# Altium schematic sheet rfid_reader.SchDoc
size 297 x 209 mm; DrawnBy: Supun; Engineer: Supun; Organization: C3
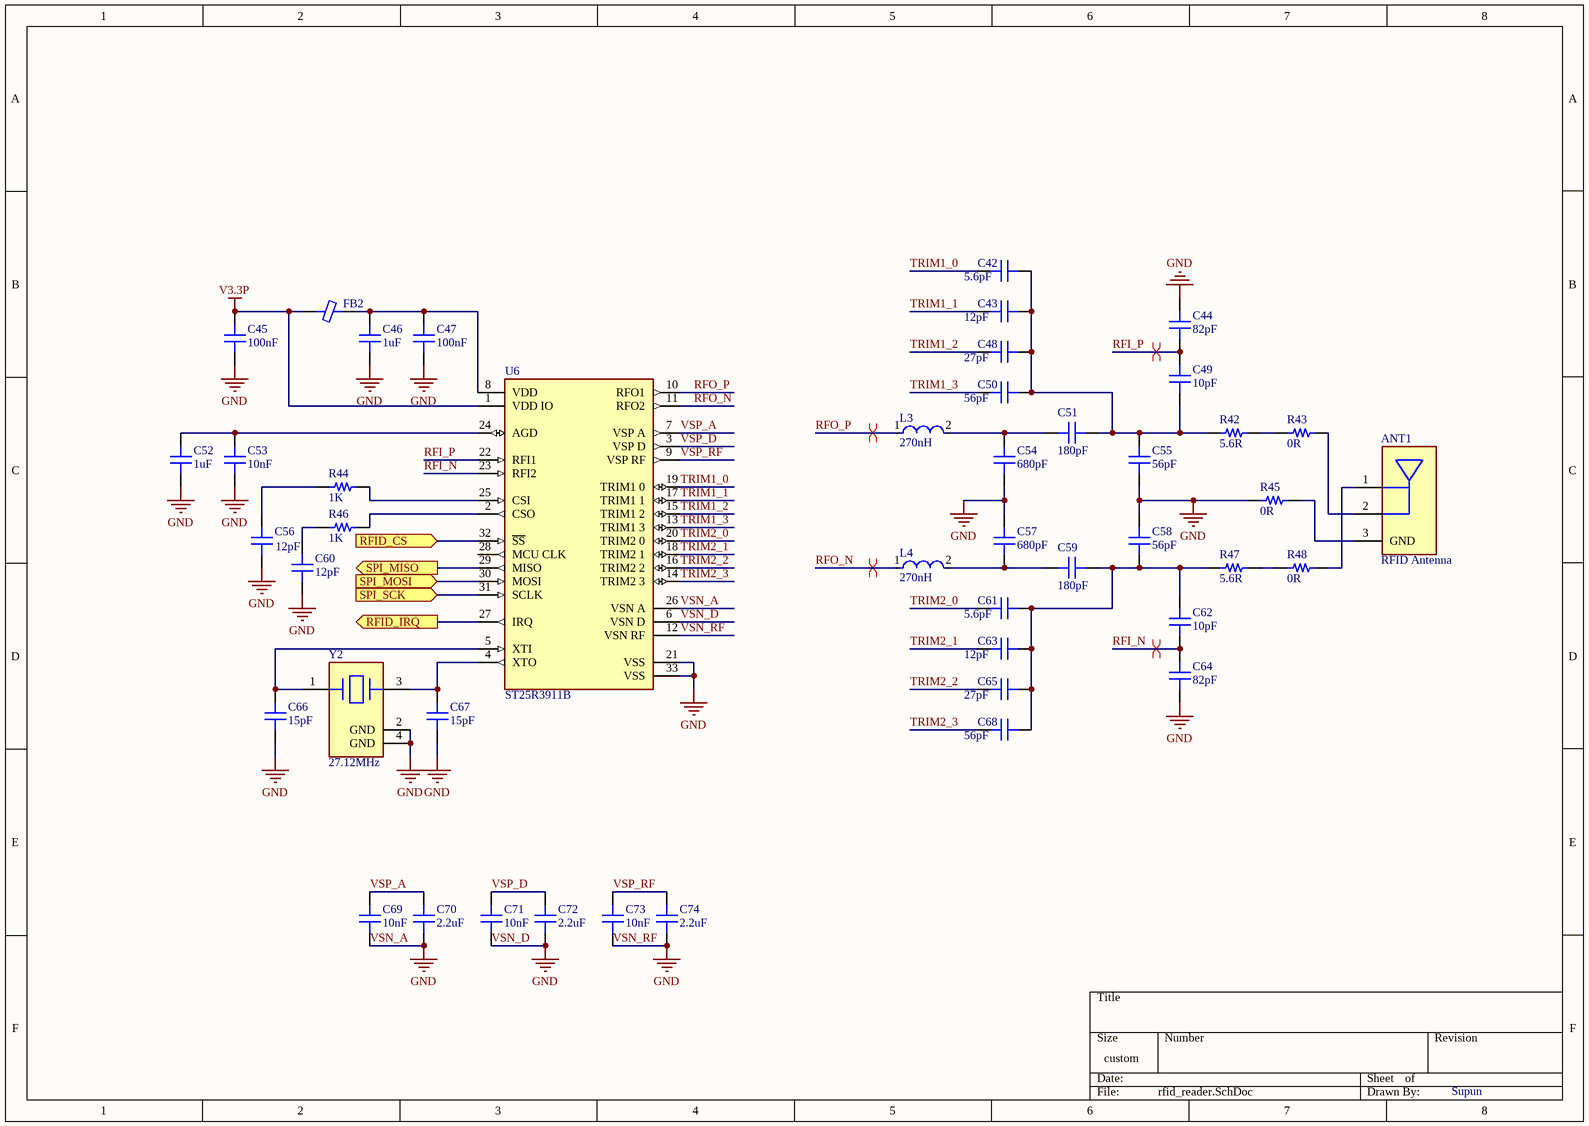
[diagram p0: rfid_reader.SchDoc]

## Parts
ANT1  RFID Antenna  [RFID_Antenna]
C42  5.6pF  [CAP 0603_1608]
C43  12pF  [CAP 0603_1608]
C44  82pF  [CAP 0603_1608]
C45  100nF  [CAP 0603_1608]
C46  1uF  [CAP 0603_1608]
C47  100nF  [CAP 0603_1608]
C48  27pF  [CAP 0603_1608]
C49  10pF  [CAP 0603_1608]
C50  56pF  [CAP 0603_1608]
C51  180pF  [CAP 0603_1608]
C52  1uF  [CAP 0603_1608]
C53  10nF  [CAP 0603_1608]
C54  680pF  [CAP 0603_1608]
C55  56pF  [CAP 0603_1608]
C56  12pF  [CAP 0603_1608]
C57  680pF  [CAP 0603_1608]
C58  56pF  [CAP 0603_1608]
C59  180pF  [CAP 0603_1608]
C60  12pF  [CAP 0603_1608]
C61  5.6pF  [CAP 0603_1608]
C62  10pF  [CAP 0603_1608]
C63  12pF  [CAP 0603_1608]
C64  82pF  [CAP 0603_1608]
C65  27pF  [CAP 0603_1608]
C66  15pF  [CAP 0603_1608]
C67  15pF  [CAP 0603_1608]
C68  56pF  [CAP 0603_1608]
C69  10nF  [CAP 0603_1608]
C70  2.2uF  [CAP 0603_1608]
C71  10nF  [CAP 0603_1608]
C72  2.2uF  [CAP 0603_1608]
C73  10nF  [CAP 0603_1608]
C74  2.2uF  [CAP 0603_1608]
FB2  (no value)  [Murata_BLM18-0_15-t0_8_MFG]
L3  270nH  [IND 0603_1608]
L4  270nH  [IND 0603_1608]
R42  5.6R  [RES 0603_1608]
R43  0R  [RES 0603_1608]
R44  1K  [RES 0603_1608]
R45  0R  [RES 0603_1608]
R46  1K  [RES 0603_1608]
R47  5.6R  [RES 0603_1608]
R48  0R  [RES 0603_1608]
U6  ST25R3911B  [ST_QFN32L-7376875_MFG]
Y2  27.12MHz  [ABRACON ABM8G]

## Ports
RFID_CS (in), RFID_IRQ (out), SPI_MISO (out), SPI_MOSI (in), SPI_SCK (in)

## Nets
V3.3P: C45.1 FB2.1 U6.1(VDD_IO)
VSN_A: C44.1 C45.2 C46.2 C47.2 C52.2 C53.2 C54.1 C55.1 C56.1 C57.2 C58.2 C60.1 C64.2 C66.2 C67.2 C69.2 C70.2 C71.2 C72.2 C73.2 C74.2 R45.1 U6.6(VSN_D) U6.12(VSN_RF) U6.21(VSS) U6.26(VSN_A) U6.33(VSS) Y2.2(GND) Y2.4(GND)  [also labelled GND, VSN_D, VSN_RF]
RFI_N: C62.2 C64.1 U6.23(RFI2)
RFI_P: C44.2 C49.1 U6.22(RFI1)
RFID_CS: U6.32(~{SS}) ; port RFID_CS
RFID_IRQ: U6.27(IRQ) ; port RFID_IRQ
RFO_N: L4.1 U6.11(RFO2)
RFO_P: L3.1 U6.10(RFO1)
SPI_MISO: U6.29(MISO) ; port SPI_MISO
SPI_MOSI: U6.30(MOSI) ; port SPI_MOSI
SPI_SCK: U6.31(SCLK) ; port SPI_SCK
TRIM1_0: C42.1 U6.19(TRIM1_0)
TRIM1_1: C43.1 U6.17(TRIM1_1)
TRIM1_2: C48.1 U6.15(TRIM1_2)
TRIM1_3: C50.1 U6.13(TRIM1_3)
TRIM2_0: C61.1 U6.20(TRIM2_0)
TRIM2_1: C63.1 U6.18(TRIM2_1)
TRIM2_2: C65.1 U6.16(TRIM2_2)
TRIM2_3: C68.1 U6.14(TRIM2_3)
VSP_A: C69.1 C70.1 U6.7(VSP_A)
VSP_D: C71.1 C72.1 U6.3(VSP_D)
VSP_RF: C73.1 C74.1 U6.9(VSP_RF)
NetANT1_1: ANT1.1 R48.2
NetANT1_2: ANT1.2 R43.2
NetANT1_3: ANT1.3(GND) R45.2
NetC42_2: C42.2 C43.2 C48.2 C49.2 C50.2 C51.1 C55.2 R42.1
NetC46_1: C46.1 C47.1 FB2.2 U6.8(VDD)
NetC51_2: C51.2 C54.2 L3.2
NetC52_1: C52.1 C53.1 U6.24(AGD)
NetC56_2: C56.2 R44.1
NetC57_1: C57.1 C59.2 L4.2
NetC58_1: C58.1 C59.1 C61.2 C62.1 C63.2 C65.2 C68.2 R47.1
NetC60_2: C60.2 R46.1
NetC66_1: C66.1 U6.5(XTI) Y2.1
NetC67_1: C67.1 U6.4(XTO) Y2.3
NetR42_2: R42.2 R43.1
NetR44_2: R44.2 U6.25(CSI)
NetR46_2: R46.2 U6.2(CSO)
NetR47_2: R47.2 R48.1

Not connected (* = marked no-connect by the designer): U6 28(MCU_CLK)

## Layout directives
differential pair; differential pair class NO_CLASS: RFI_N, RFI_P, RFO_N, RFO_P

## Notes on the sheet
- Title
- Size:
- Date:
- A4
- Number:
- Time:
- Revision:
- Sheet
- of
- File:

## Library data of the parts
ANT1 = Loop Antenna: 13.56MHz RFID Antenna 926.04 nH; MF: SAH; MP: *; Value: RFID Antenna
C42 C61 = Capacitor: SMT Capacitor; MF: Murata; MP: GRM1885C1H5R6BA01D; Value: 5.6pF
C43 C56 C60 C63 = Capacitor: SMT Capacitor; MF: Murata; MP: GRM1885C1H120JA01J; Value: 12pF
C44 C64 = Capacitor: SMT Capacitor; MF: Murata; MP: GRM1885C1H820GA01D; Value: 82pF
C45 C47 = Capacitor: SMT Capacitor; MF: KEMET; MP: C0603C104K4PACTU; Value: 100nF
C46 C52 = Capacitor: SMT Capacitor; MF: Samsung Electro-Mechanics; MP: CL10A105KO8NNND; Value: 1uF
C48 C65 = Capacitor: SMT Capacitor; MF: Murata; MP: GRM1885C1H270JA01D; Value: 27pF
C49 C62 = Capacitor: SMT Capacitor; MF: Murata; MP: GRM1885C1H100GA01D; Value: 10pF
C50 C55 C58 C68 = Capacitor: SMT Capacitor; MF: Murata; MP: GRM1885C1H560JA01J; Value: 56pF
C51 C59 = Capacitor: SMT Capacitor; MF: Murata; MP: GRM1885C1H181GA01D; Value: 180pF
C53 C69 C71 C73 = Capacitor: SMT Capacitor; MF: Samsung Electro-Mechanics; MP: CL10B103KA8WPNC; Value: 10nF
C54 C57 = Capacitor: SMT Capacitor; MF: Murata; MP: GRM1885C1H681GA01D; Value: 680pF
C66 C67 = Capacitor: SMT Capacitor; MF: Murata; MP: GRM1885C1H150JA01J; Value: 15pF
C70 C72 C74 = Capacitor: SMT Capacitor; MF: Samsung Electro-Mechanics; MP: CL10A225KP8NNNC; Value: 2.2uF
FB2 = Ferrite Chip: SMT Ferrite Chip; MF: Murata Electronics; MP: BLM18AG331SN1D
L3 L4 = Inductor_sm: Fixed Inductors 2.2uH 20% High Temp AEC-Q200; MF: Murata; MP: LQW18ANR27G80D; Value: 270nH
R42 R47 = Resistor: SMT Resistor; MF: Vishay; MP: CRCW06035R62FKEA; Value: 5.6R
R43 R45 R48 = Resistor: SMT Resistor; MF: Vishay; MP: RCC06030000Z0EA; Value: 0R
R44 R46 = Resistor: SMT Resistor; MF: Vishay; MP: CRCW06031K00FKEAC; Value: 1K
U6 = ST25R3911B: IC RFID Reader IC 13.56MHz ISO 14443, NFC SPI 2.4 V ~ 5.5 V 32-VFQFN Exposed Pad; MF: STMicroelectronics; Mfg Package Ident: VFQFPN 5X5 32L PAD 3.5X3 PUNCHED; MP: ST25R3911B-AQFT; helpURL: https://upverter.com/upn/revision/304b28992a5390e4/; ComponentLink2Description: Datasheet; Temperature: -40°C to +125°C; Package: VFQFPN 5X5 32L PAD 3.5X3 PUNCHED; Supplier 2: Mouser; Price: 4.27699994866; Supplier 1: Digi-Key; ComponentLink1URL: https://upverter.com/upn/revision/304b28992a5390e4/; Supplier Part Number 2: 511-ST25R3911B-AQFT; Supplier Part Number 1: ST25R3911B-AQFTCT-ND; ComponentLink1Description: Upverter; ComponentLink2URL: http://www.st.com/content/ccc/resource/technical/document/datasheet/group3/ba/60/79/5c/bb/a9/41/76/DM00321525/files/DM00321525.pdf/jcr:content/translations/en.DM00321525.pdf; RoHS: TRUE; Mouser Part Number: 511-ST25R3911B-AQFT; Temperature Range High: +125°C; Digikey Description: IC RFID Reader IC 13.56MHz ISO 14443, NFC SPI 2.4 V ~ 5.5 V 32-VFQFN Exposed Pad; Digikey Part Number: ST25R3911B-AQFTCT-ND; Interface: SPI; Lead Free: yes; Standards: ISO 14443, NFC; Temperature Range Low: -40°C; Ipc Land Pattern Name: QFN50P500X500X90-32; Voltage - Supply: 2.4V ~ 5.5V; Frequency: 13.56MHz
Y2 = Crystal: Crystals AEC-Q200 CRYSTAL 4pin SMD; MF: ECS; MP: ECS-271.2-8-33-RWY-TR; Value: 27.12MHz